# Altium project camizqu_brakelight.PrjPcb
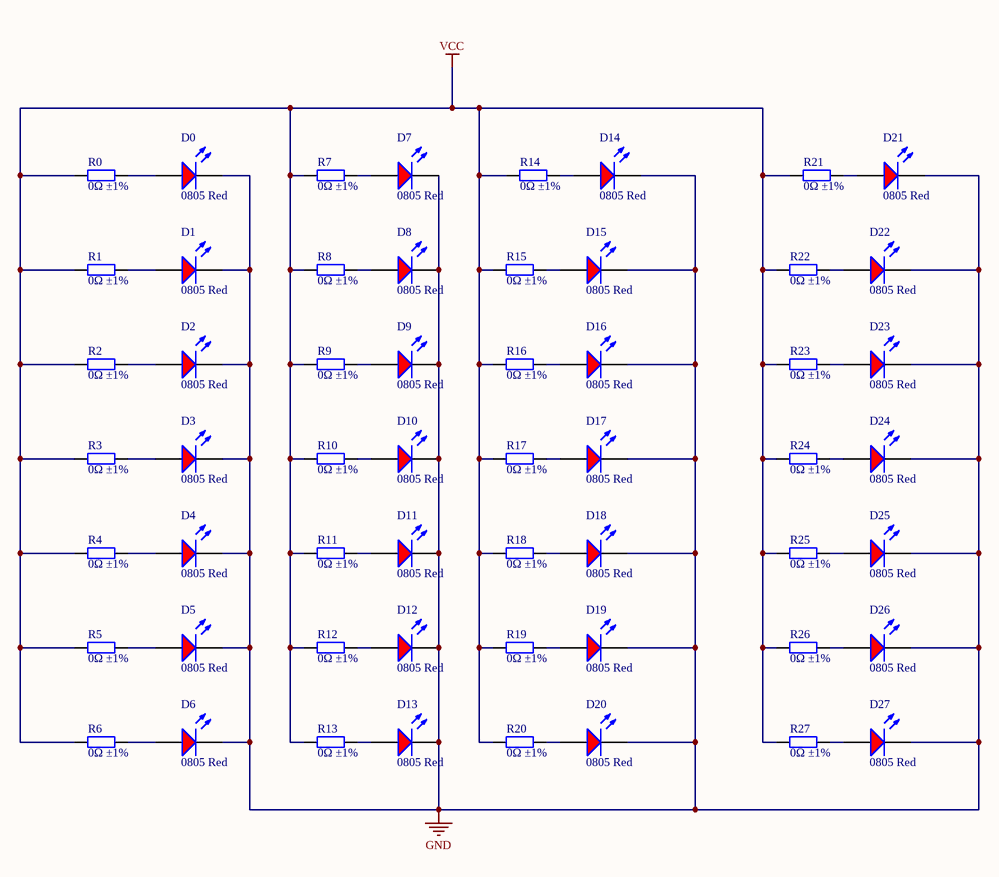
[diagram p0: top.SchDoc]
1 sheet, 56 parts. Net scope: global (net labels, ports and power ports of the same name join across sheets).
Board file: PCB1.PcbDoc

## Sheet top.SchDoc
size A4; SheetNumber: 1; SheetTotal: 1; SPICEModelCacheSJOVBSUH: <root> / <DocumentId>SJOVBSUH</DocumentId> / </root>

### Parts
D0  0805 Red  [0805_LED_S1]
D1  0805 Red  [0805_LED_S1]
D2  0805 Red  [0805_LED_S1]
D3  0805 Red  [0805_LED_S1]
D4  0805 Red  [0805_LED_S1]
D5  0805 Red  [0805_LED_S1]
D6  0805 Red  [0805_LED_S1]
D7  0805 Red  [0805_LED_S1]
D8  0805 Red  [0805_LED_S1]
D9  0805 Red  [0805_LED_S1]
D10  0805 Red  [0805_LED_S1]
D11  0805 Red  [0805_LED_S1]
D12  0805 Red  [0805_LED_S1]
D13  0805 Red  [0805_LED_S1]
D14  0805 Red  [0805_LED_S1]
D15  0805 Red  [0805_LED_S1]
D16  0805 Red  [0805_LED_S1]
D17  0805 Red  [0805_LED_S1]
D18  0805 Red  [0805_LED_S1]
D19  0805 Red  [0805_LED_S1]
D20  0805 Red  [0805_LED_S1]
D21  0805 Red  [0805_LED_S1]
D22  0805 Red  [0805_LED_S1]
D23  0805 Red  [0805_LED_S1]
D24  0805 Red  [0805_LED_S1]
D25  0805 Red  [0805_LED_S1]
D26  0805 Red  [0805_LED_S1]
D27  0805 Red  [0805_LED_S1]
R0  0Ω ±1%  [0402_R]
R1  0Ω ±1%  [0402_R]
R2  0Ω ±1%  [0402_R]
R3  0Ω ±1%  [0402_R]
R4  0Ω ±1%  [0402_R]
R5  0Ω ±1%  [0402_R]
R6  0Ω ±1%  [0402_R]
R7  0Ω ±1%  [0402_R]
R8  0Ω ±1%  [0402_R]
R9  0Ω ±1%  [0402_R]
R10  0Ω ±1%  [0402_R]
R11  0Ω ±1%  [0402_R]
R12  0Ω ±1%  [0402_R]
R13  0Ω ±1%  [0402_R]
R14  0Ω ±1%  [0402_R]
R15  0Ω ±1%  [0402_R]
R16  0Ω ±1%  [0402_R]
R17  0Ω ±1%  [0402_R]
R18  0Ω ±1%  [0402_R]
R19  0Ω ±1%  [0402_R]
R20  0Ω ±1%  [0402_R]
R21  0Ω ±1%  [0402_R]
R22  0Ω ±1%  [0402_R]
R23  0Ω ±1%  [0402_R]
R24  0Ω ±1%  [0402_R]
R25  0Ω ±1%  [0402_R]
R26  0Ω ±1%  [0402_R]
R27  0Ω ±1%  [0402_R]

### Nets
GND: D0.K D1.K D2.K D3.K D4.K D5.K D6.K D7.K D8.K D9.K D10.K D11.K D12.K D13.K D14.K D15.K D16.K D17.K D18.K D19.K D20.K D21.K D22.K D23.K D24.K D25.K D26.K D27.K
VCC: R0.1 R1.1 R2.1 R3.1 R4.1 R5.1 R6.1 R7.1 R8.1 R9.1 R10.1 R11.1 R12.1 R13.1 R14.1 R15.1 R16.1 R17.1 R18.1 R19.1 R20.1 R21.1 R22.1 R23.1 R24.1 R25.1 R26.1 R27.1
NetD0_A: D0.A R0.2
NetD1_A: D1.A R1.2
NetD2_A: D2.A R2.2
NetD3_A: D3.A R3.2
NetD4_A: D4.A R4.2
NetD5_A: D5.A R5.2
NetD6_A: D6.A R6.2
NetD7_A: D7.A R7.2
NetD8_A: D8.A R8.2
NetD9_A: D9.A R9.2
NetD10_A: D10.A R10.2
NetD11_A: D11.A R11.2
NetD12_A: D12.A R12.2
NetD13_A: D13.A R13.2
NetD14_A: D14.A R14.2
NetD15_A: D15.A R15.2
NetD16_A: D16.A R16.2
NetD17_A: D17.A R17.2
NetD18_A: D18.A R18.2
NetD19_A: D19.A R19.2
NetD20_A: D20.A R20.2
NetD21_A: D21.A R21.2
NetD22_A: D22.A R22.2
NetD23_A: D23.A R23.2
NetD24_A: D24.A R24.2
NetD25_A: D25.A R25.2
NetD26_A: D26.A R26.2
NetD27_A: D27.A R27.2

### Library data of the parts
D0-D27 = 0805 LED Red: LED; ComponentLink1Description: 供应商链接; ComponentLink1URL: http://www.szlcsc.com/product/details_2668.html; Package: 0805; Supplier: LC; SuppliersPartNumber: C2295; Color: Red
R0-R27 = 0402 0R (0R0) 1%: Chip resistor; Manufacturer: Uniroyal Elec; PartNumber: 0402WGF0000TCE; Power: 1/16W; ComponentLink1Description: Supplier link; ComponentLink1URL: http://www.szlcsc.com/product/details_17853.html; Package: 0402; Supplier: LC; SuppliersPartNumber: C17168; Resistance: 0Ω; Tolerance: 1%